# EasyEDA Pro project ProProject_ESP32-CAN (1)_2024-07-23.epro, schematic esp32 devkit v1 shield
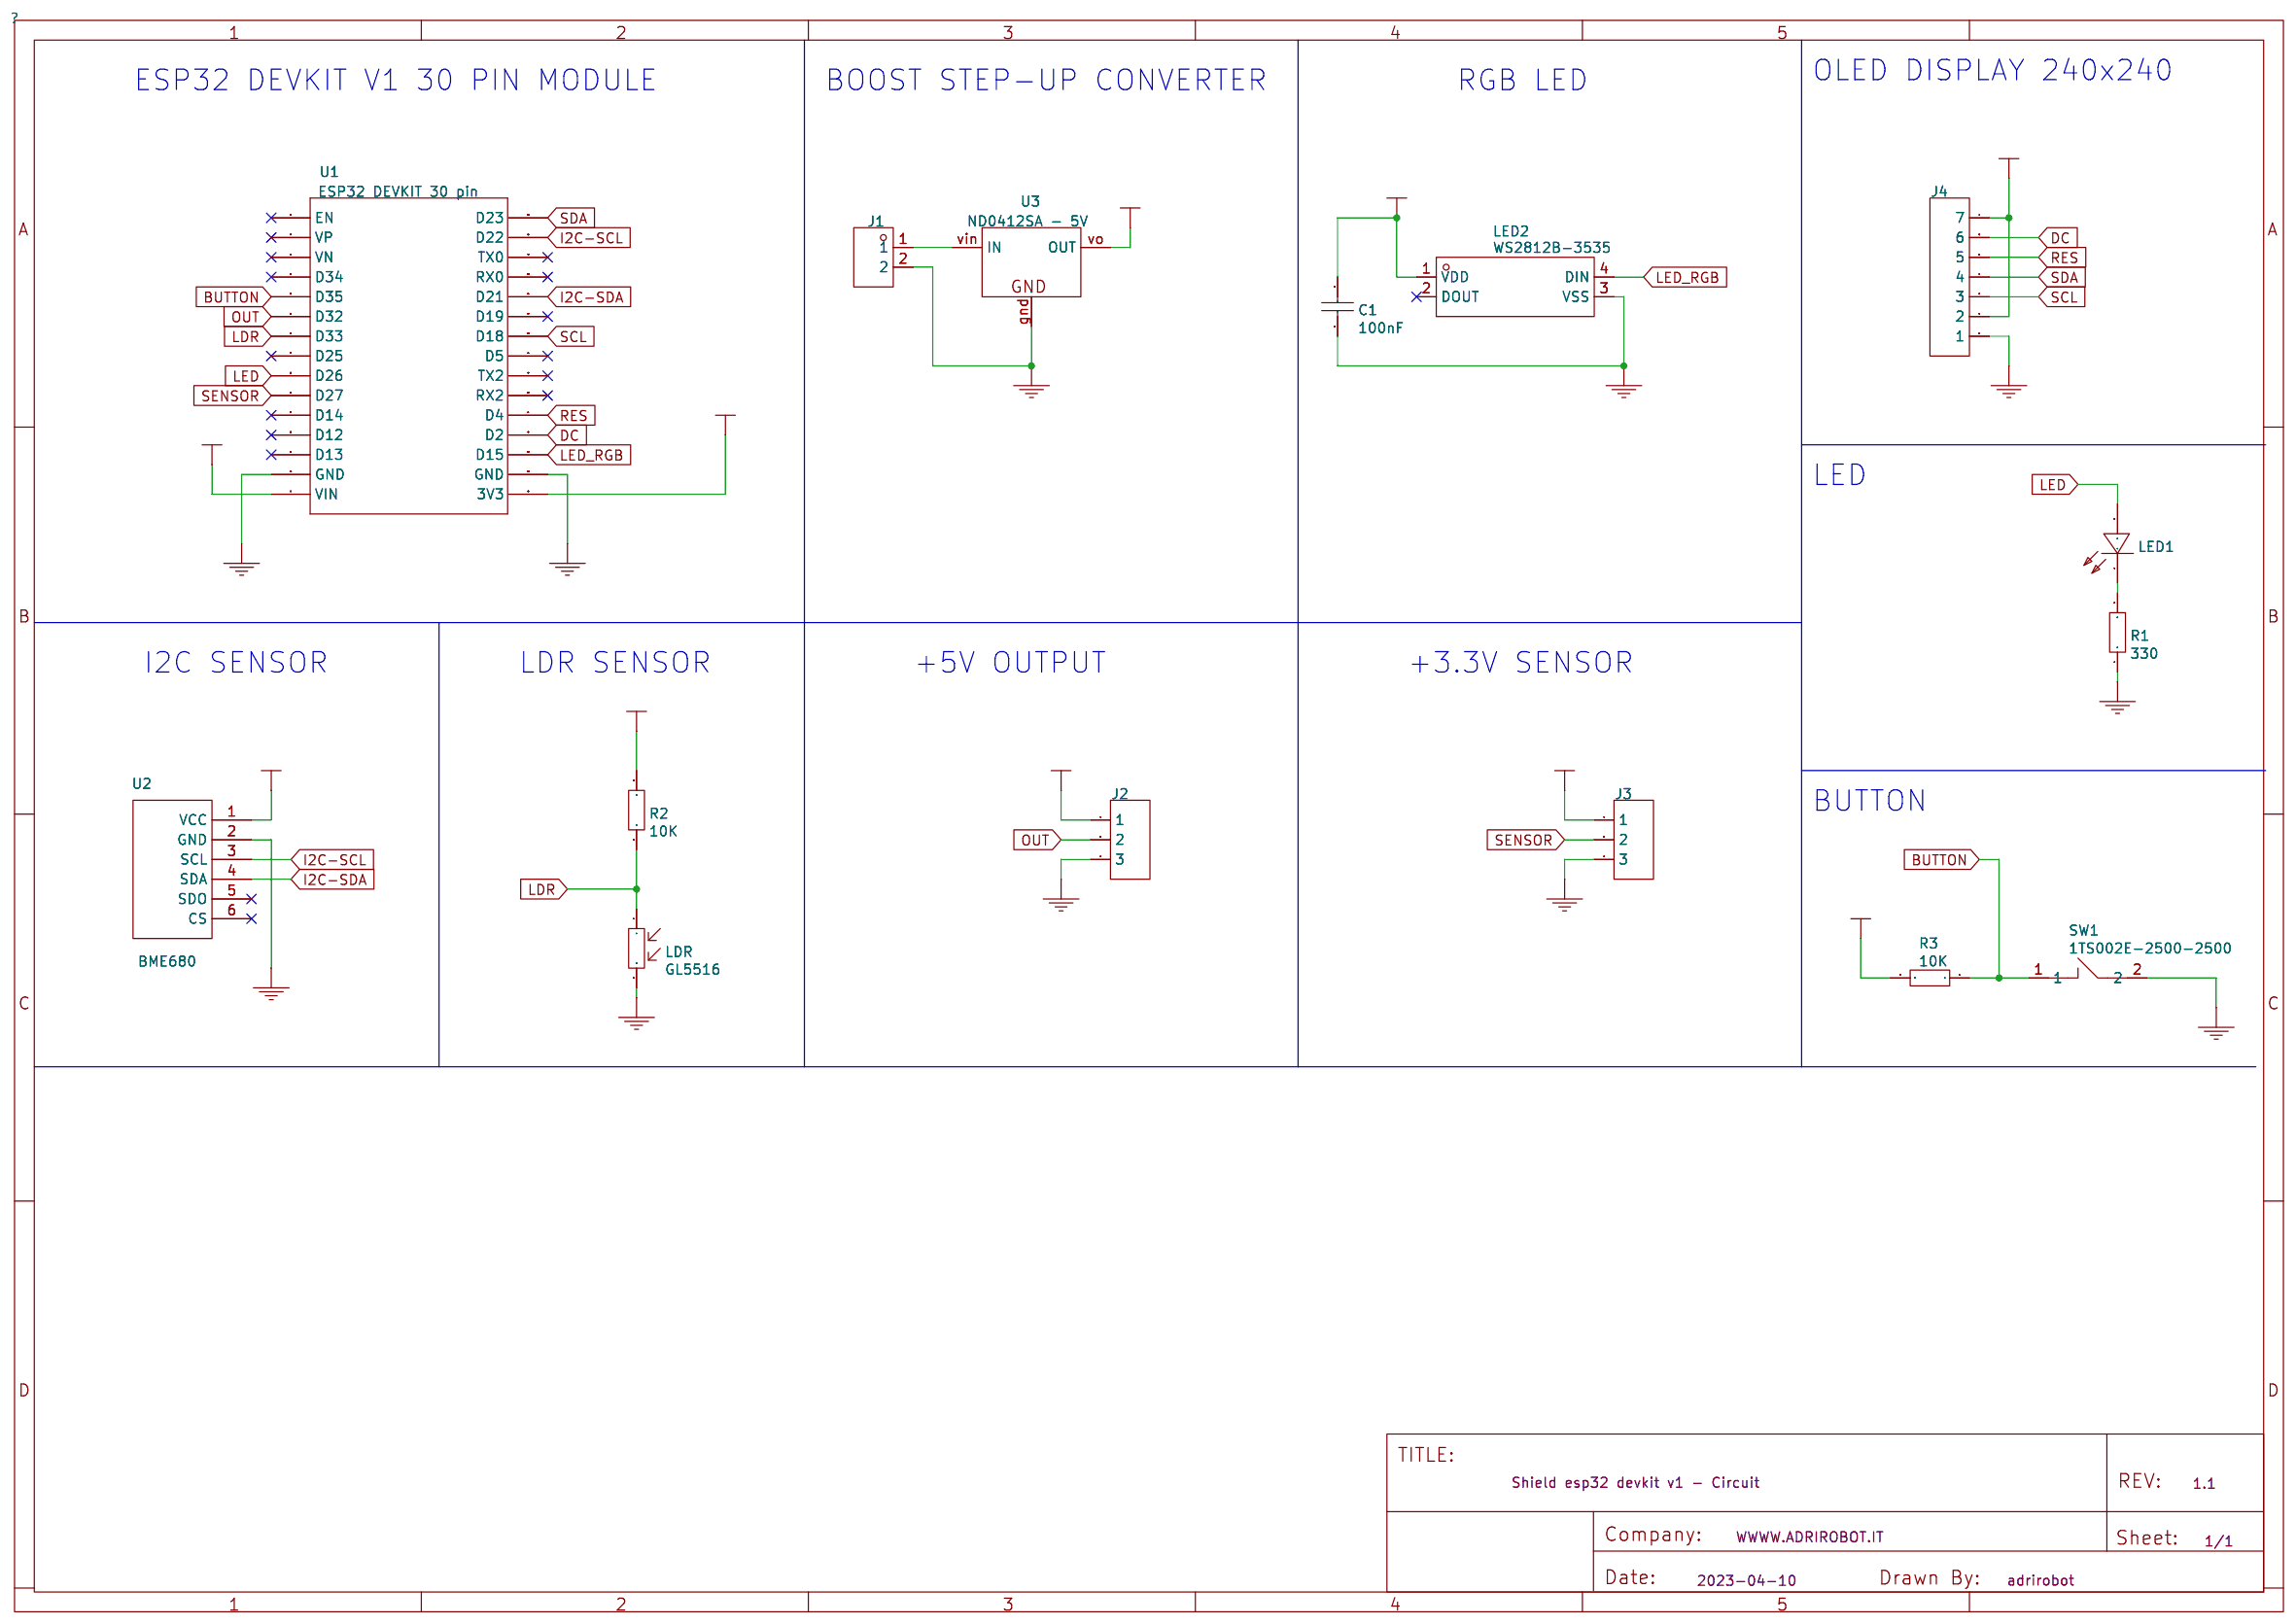
[diagram p1: schematic sheet]

## Parts
C1  100nF
J1  MTB125-1102R1
J2  Header-Female-2.54_1x3
J3  Header-Female-2.54_1x3
J4  CONN_01X07
LDR  GL5516
LED1  XL-0805QBC
LED2  WS2812B-3535
R1  330
R2  10K
R3  10K
SW1  1TS002E-2500-2500
U1  ESP32 DEVKIT 30 pin
U2  BME680
U3  ND0412SA - 5V

## Library data of the parts
C1 = 100nF: Supplier: LCSC; Manufacturer Part: CL21B104JBCNNNC; Manufacturer: SAMSUNG; Supplier Part: C62912; JLCPCB Part Class: Basic; JLCPCB SMD: Yes
J1 = MTB125-1102R1: Supplier: LCSC; Supplier Part: C376120; Manufacturer: MINTRON; JLCPCB Part Class: Extended Part
J2 J3 = Header-Female-2.54_1x3: Supplier Part: C225500; Supplier: LCSC; Manufacturer: Changjiang Connectors; Manufacturer Part: A2541HWV-3P; link: https://datasheet.lcsc.com/szlcsc/Boom-Precision-Elec-2-54mm-1-8P-Straight-Female-header_C27438.pdf; JLCPCB Part Class: Extended Part
J4 = CONN_01X07
LDR = GL5516: Supplier: LCSC; Manufacturer: 森霸; Supplier Part: C125626; JLCPCB Part Class: Extended Part
LED1 = XL-0805QBC: Supplier: LCSC; Manufacturer: EVERLIGHT; Manufacturer Part: 17-21SURC/S530-A3/TR8; Supplier Part: C72037; JLCPCB Part Class: Basic; JLCPCB SMD: Yes
LED2 = WS2812B-3535: Supplier: LCSC; Manufacturer: Worldsemi; Supplier Part: C114583; JLCPCB Part Class: Extend; JLCPCB SMD: Yes
R1 = 330: Supplier: LCSC; Supplier Part: C17630; Manufacturer: UniOhm; Manufacturer Part: 0805W8F3300T5E; JLCPCB Part Class: Extend; JLCPCB SMD: Yes
R2 R3 = 10K: Supplier: LCSC; Supplier Part: C17414; Manufacturer: UniOhm; Manufacturer Part: 0805W8F1002T5E; JLCPCB Part Class: Extend; JLCPCB SMD: Yes
SW1 = 1TS002E-2500-2500: Supplier: LCSC; Supplier Part: C329185; Manufacturer: HYP; JLCPCB Part Class: Extended Part
U1 = ESP32 DEVKIT 30 pin
U2 = BME680: Manufacturer Part: New SchematicLib
U3 = ND0412SA - 5V: Supplier Part: ND0412SA; Supplier: Pololu

## Nets
+3V3: J3.1 J4.2 J4.7 R2.2 R3.2 U1.3V3 U2.1(VCC)
+5V: C1.2 J2.1 LED2.1(VDD) U1.VIN U3.vo(OUT)
GND: C1.1 J1.2 J2.3 J3.3 J4.1 LDR.2 LED2.3(VSS) R1.1 SW1.2 U1.GND@1(GND) U1.GND@2(GND) U2.2(GND) U3.gnd(GND)
BUTTON: R3.1 SW1.1 U1.D35
DC: J4.6 U1.D2
I2C-SCL: U1.D22 U2.3(SCL)
I2C-SDA: U1.D21 U2.4(SDA)
LDR: LDR.1 R2.1 U1.D33
LED: LED1.2(A) U1.D26
LED_RGB: LED2.4(DIN) U1.D15
OUT: J2.2 U1.D32
RES: J4.5 U1.D4
SCL: J4.3 U1.D18
SDA: J4.4 U1.D23
SENSOR: J3.2 U1.D27
Net-(J1-1): J1.1 U3.vin(IN)
Net-(LED1-1): LED1.1(K) R1.2

Not connected (* = marked no-connect by the designer): LED2 2(DOUT)*; U1 D5* D12* D13* D14* D19* D25* D34* EN* RX0* RX2* TX0* TX2* VN* VP*; U2 5(SDO)* 6(CS)*

## Notes on the sheet
- ESP32 DEVKIT V1 30 PIN MODULE
- BOOST STEP-UP CONVERTER
- RGB LED
- OLED DISPLAY 240x240
- LED
- I2C SENSOR
- LDR SENSOR
- +5V OUTPUT
- +3.3V SENSOR
- BUTTON
